# Altium schematic sheet Sheet1.SchDoc
size A4; SheetNumber: 1; SheetTotal: 1
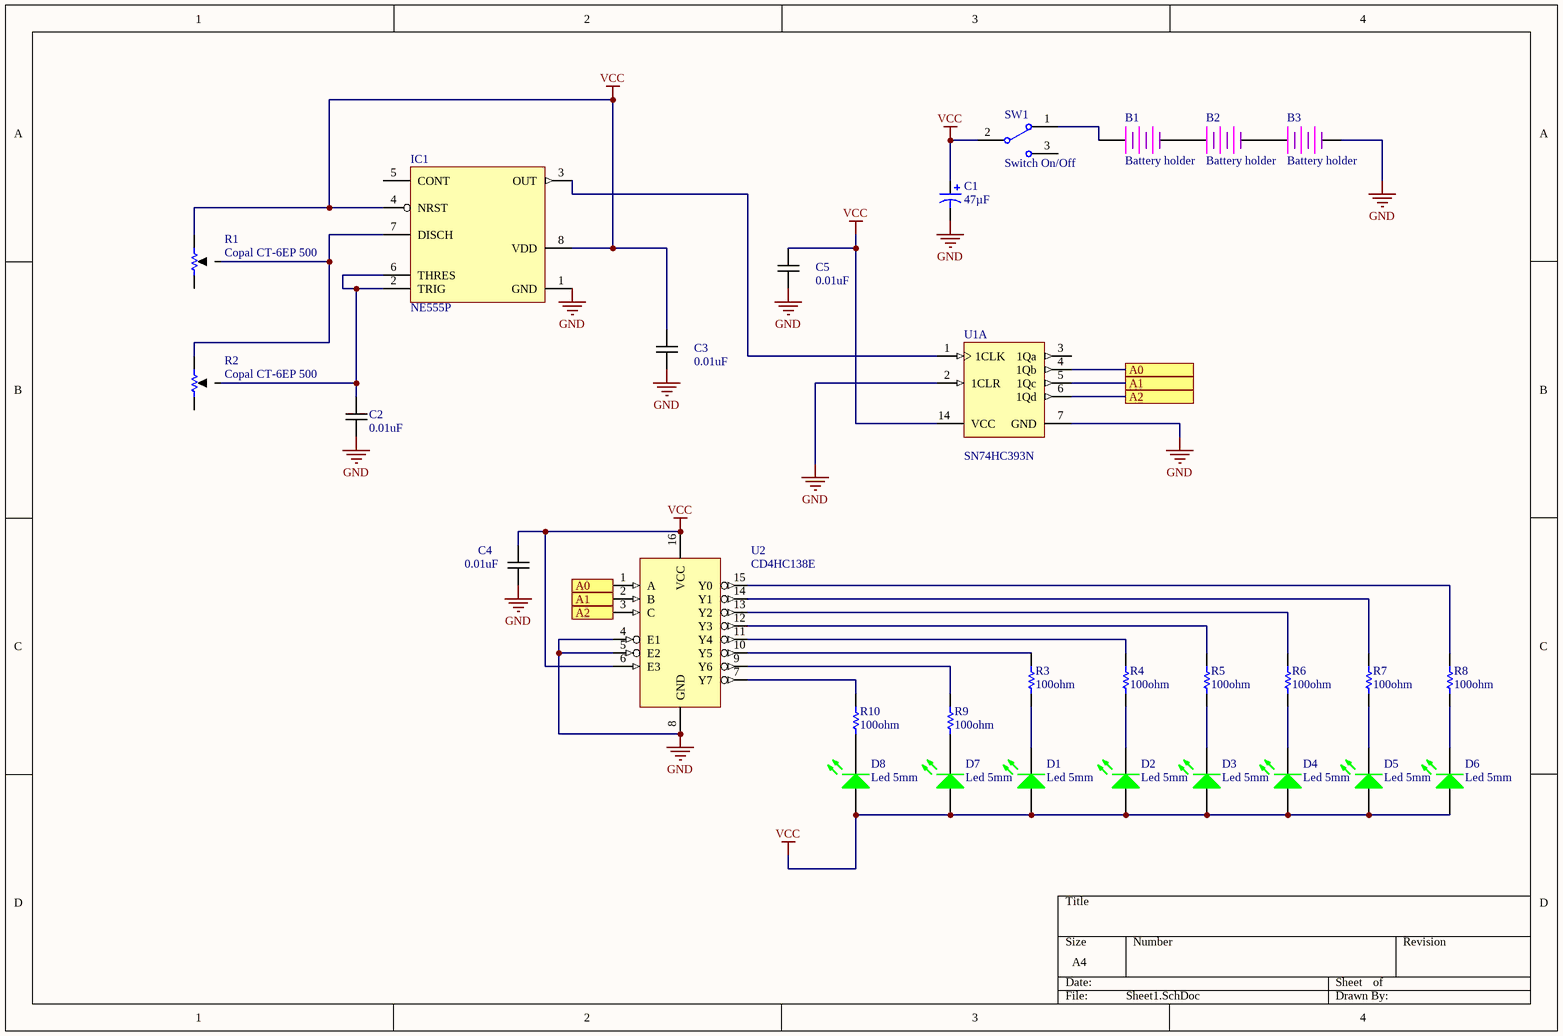
[diagram p0: Sheet1.SchDoc]

## Parts
B1  Battery holder  [PCB-2466]
B2  Battery holder  [PCB-2466]
B3  Battery holder  [PCB-2466]
C1  Capacitance: 47µF  [PCB-sifwkspbqc1qlrd8eies-1]
C2  0.01uF  [PCB-au503zkymb715iten6nm-1]
C3  0.01uF  [PCB-au503zkymb715iten6nm-1]
C4  0.01uF  [PCB-au503zkymb715iten6nm-1]
C5  0.01uF  [PCB-au503zkymb715iten6nm-1]
D1  Led 5mm  [Type 5mm]
D2  Led 5mm  [Type 5mm]
D3  Led 5mm  [Type 5mm]
D4  Led 5mm  [Type 5mm]
D5  Led 5mm  [Type 5mm]
D6  Led 5mm  [Type 5mm]
D7  Led 5mm  [Type 5mm]
D8  Led 5mm  [Type 5mm]
IC1  NE555P  [PCB-4931250-2]
R1  Copal CT-6EP 500  [PCB-rbleyuev9qgaao4tgw2o-1]
R2  Copal CT-6EP 500  [PCB-rbleyuev9qgaao4tgw2o-1]
R3  100ohm  [PCB-daacjafbitkopfw0mrwc-1]
R4  100ohm  [PCB-daacjafbitkopfw0mrwc-1]
R5  100ohm  [PCB-daacjafbitkopfw0mrwc-1]
R6  100ohm  [PCB-daacjafbitkopfw0mrwc-1]
R7  100ohm  [PCB-daacjafbitkopfw0mrwc-1]
R8  100ohm  [PCB-daacjafbitkopfw0mrwc-1]
R9  100ohm  [PCB-daacjafbitkopfw0mrwc-1]
R10  100ohm  [PCB-daacjafbitkopfw0mrwc-1]
SW1  Switch On/Off  [ESWI-EG1218_V]
U1  SN74HC393N  [PCB-te1ukpb7ypv15gwynu8x-1]  (part A of 2)
U2  CD4HC138E  [PCB-iqyivjlmuk83cucpld0n-1]

## Ports
A0, A1, A2

## Nets
GND: B3.2(-) C1.2 C2.1 C3.1 C4.1 C5.1 IC1.1(GND) U1.2(1CLR) U1.7(GND) U2.4(E1) U2.5(E2) U2.8(GND)
VCC: C1.1 C3.2 C4.2 C5.2 D1.1(A) D2.1(A) D3.1(A) D4.1(A) D5.1(A) D6.1(A) D7.1(A) D8.1(A) IC1.4(NRST) IC1.8(VDD) R1.3 SW1.2(COM) U1.14(VCC) U2.6(E3) U2.16(VCC)
A0: U1.4(1Qb) U2.1(A) ; port A0
A1: U1.5(1Qc) U2.2(B) ; port A1
A2: U1.6(1Qd) U2.3(C) ; port A2
NetB1_1: B1.1(+) SW1.1
NetB1_2: B1.2(-) B2.1(+)
NetB2_2: B2.2(-) B3.1(+)
NetC2_2: C2.2 IC1.2(TRIG) IC1.6(THRES) R2.2
NetD1_2: D1.2(K) R3.0
NetD2_2: D2.2(K) R4.0
NetD3_2: D3.2(K) R5.0
NetD4_2: D4.2(K) R6.0
NetD5_2: D5.2(K) R7.0
NetD6_2: D6.2(K) R8.0
NetD7_2: D7.2(K) R9.0
NetD8_2: D8.2(K) R10.0
NetIC1_3: IC1.3(OUT) U1.1(1CLK)
NetIC1_7: IC1.7(DISCH) R1.2 R2.3
NetR3_1: R3.1 U2.10(Y5)
NetR4_1: R4.1 U2.11(Y4)
NetR5_1: R5.1 U2.12(Y3)
NetR6_1: R6.1 U2.13(Y2)
NetR7_1: R7.1 U2.14(Y1)
NetR8_1: R8.1 U2.15(Y0)
NetR9_1: R9.1 U2.9(Y6)
NetR10_1: R10.1 U2.7(Y7)

Not connected (* = marked no-connect by the designer): IC1 5(CONT); R1 1; R2 1; SW1 3; U1 3(1Qa)

## Library data of the parts
B1-B3 = CMP-3612-20: Battery holder, AAA, 1 cell, PC mount; Manufacturer Name: Keystone Electronics; Manufacturer Part Number: 2466; Lead-Free Status: Lead Free; RoHS: Compliant; Octopart Url: https://octopart.com/2466-keystone-65856; Contact Plating: Nickel; Material: Plastic; Supplier URL: https://www.digikey.ca/product-detail/en/keystone-electronics/2466/36-2466-ND/303815; Supplier Name: Digikey; OctopartID: fe0e3705da2821c9; Supplier PN: 36-2466-ND
C1 = CMP-9b5e516214744499-1: Al Electrolytic Capacitors 47uF 25V 20% 105°C; Manufacturer Part Number: 860020472006; OctopartID: 9b5e516214744499; Voltage Rating: 25v; Mounting Style: Through Hole; Octopart URL: http://octopart.com/860020472006-w%C3%BCrth+elektronik-53914188; Operating Temperature: 2000 Hrs @ 105°C; Packaging: Tape & Box (TB); Tolerance: ±20%
C2-C5 = CMP-124240-17: K Series 100nF 50 V ±10 % Tolerance X7R Radial Multilayer Ceramic Capacitor; Manufacturer Part Number: K104K15X7RF5TL2; Voltage Rating (DC): 50.0 V; Capacitance: 1e-07 F; Lead-Free Status: Lead Free; Capacitance Tolerance: ±10%; Lead Length: 0.03 m; Packaging: Cut Tape (CT), Tape & Reel (TR); Size-Height: 0.00381 m; Size-Length: 0.004 m; Mounting Style: Through Hole; Size-Diameter: 0.000508 m; Size-Width: 0.00381 m; Octopart URL: http://octopart.com/k104k15x7rf5tl2-vishay+bccomponents-199226; OctopartID: e7292e20c87538ee; Dielectric Characteristic: X7R; Dielectric Material: Ceramic; Size-Thickness: 0.00254 m; Number of Pins: 2; RoHS: Compliant
D1-D8 = CMP-12518896-9: THT LED round mono-color color lens, WL-TMRW, Bright Green; Manufacturer Part Number: 151051VS04000; Forward Voltage: 2.1 V; Luminous Intensity: 0.14 cd; Viewing Angle: 40 °; OctopartID: 7dcdb5022d9da20a; Octopart Url: https://octopart.com/151051vs04000-w%C3%BCrth+elektronik-29717814; REACH SVHC Compliance: No SVHC; RoHS: Compliant
IC1 = CMP-4931250-17: Standard Timer Single 8-Pin PDIP; CiivaID: 4931250; Ciiva URL: https://ciiva.com/part/ne555p-4931250; Manufacturer Part Number: NE555P; Packaging: Bulk
R1 R2 = CMP-a90f6004a7c476c8-1: Res Cermet Trimmer 500 Ohm 10% 1/2W 1(Elec)/1(Mech)Turn 2.6mm (7 X 7 X 5.8mm) Pin Thru-Hole Bulk; Power Rating: 0.5 W; Lead-Free Status: Lead Free; Resistance: 50.0 Ω; Octopart URL: http://octopart.com/ct-6ep+500-copal-76717; Resistance Tolerance: ±10%; Packaging: Bulk; OctopartID: a90f6004a7c476c8; Size-Height: 0.0058 m; Size-Width: 0.007 m; Manufacturer Part Number: CT-6EP 500; Mounting Style: Through Hole; Size-Length: 0.007 m; Weight: 0.51 g; RoHS: Compliant; Color: Blue
R3-R10 = CMP-56c39eec7e368904-1: Res Carbon Film 62K Ohm 5% 0.25W(1/4W) -500ppm/ to 0ppm/ Conformal Coated AXL T/R; Manufacturer Part Number: CF14JT62K0; Power Rating: 250 mW; Lead-Free Status: Lead Free; Resistance: 62.0 kΩ; Octopart URL: https://octopart.com/cf14jt62k0-stackpole+electronics-19205523; Mounting Style: Axial; Packaging: Tape & Reel (TR); Resistance Tolerance: ±5%; RoHS: Compliant; Contact Plating: Tin over Copper; OctopartID: 56c39eec7e368904
SW1 = CMP-9a5a5340a2f5459d-17: Slide Switch, 500 V, -20 to 70 degC, 3-Pin THD, RoHS; Manufacturer Part Number: EG1218; Current Rating: 200 mA; Contacts Type: SPDT; Number of Positions: 2; Lead-Free Status: Lead Free; Actuator Type: Standard; PackageDescription: 3-Pin Through Hole Device, Body 11.6 x 4 mm, Pitch 2.5 mm; RoHS: Compliant; DatasheetVersion: Oct-15; Mounting Style: PCB, Through Hole; Size-Height: 5.40 mm; Size-Length: 2.03 mm; Seller Landing  Url: https://octopart-clicks.com/click/track?country=US&ak=8157f166&sig=0e9adab&sid=459&ppid=1056201&vpid=1179261&ct=offers; Orientation: Vertical; PackageReference: EG1218; Packaging: Bulk; Size-Width: 4.00 mm; OctopartID: 9a5a5340a2f5459d; Octopart Url: http://octopart.com/eg1218-e-switch-1056201; Contact Plating: Silver; Contact Material: Copper Alloy
U1 = CMP-3c53f5596157e394-2: Texas Instruments - SN74HC393N - Counter/Divider Dual 4-Bit Binary UP 14-Pin PDIP Tube; Voltage Nodes: 2.00 V, 6.00 V, 5.00 V; Clock Speed: 60.0 MHz; Lead-Free Status: Lead Free; Number of Bits: 4; Output Current Drive: -1.00 mA; Supply Voltage (DC): 2.00 V to 6.00 V; REACH SVHC Compliance: No SVHC; Case/Package: PDIP; RoHS: Compliant; Packaging: Tube; OctopartID: 3c53f5596157e394; Mounting Style: Through Hole; Octopart URL: https://octopart.com/sn74hc393n-texas+instruments-30818; Lifecycle Status: Active; Number of Pins: 14; Operating Temperature: -40.0 °C to 85.0 °C; Manufacturer Part Number: SN74HC393N
U2 = CMP-1166716-8: TEXAS INSTRUMENTS   CD74HC138E   Logic Type:Decoder / Demultiplexer; Propagation Delay: 265 ns; Output Current: 5.2 mA; Lead-Free Status: Lead Free; Operating Supply Voltage: 2 V to 6 V; Number of Bits: 8; Number of Circuits: 1; Operating Supply Voltage (typical): 2.5V / 3.3V / 5.0V; Octopart Url: https://octopart.com/cd74hc138e-harris-4046706; REACH SVHC Compliance: No SVHC; Operating Temperature: -55C to 125C; Package: PDIP; Manufacturer: Texas Instruments; Mounting Style: Through Hole; Number of Outputs: 8; RoHS: Compliant; Packaging: Tube; Manufacturer Part Number: CD74HC138E; OctopartID: 2c46e54acdf8f381; Number of Pins: 16; Lifecycle Status: Active